# Altium schematic sheet p2_wire_compensation.SchDoc
size A2; SheetNumber: 2; SheetTotal: 2
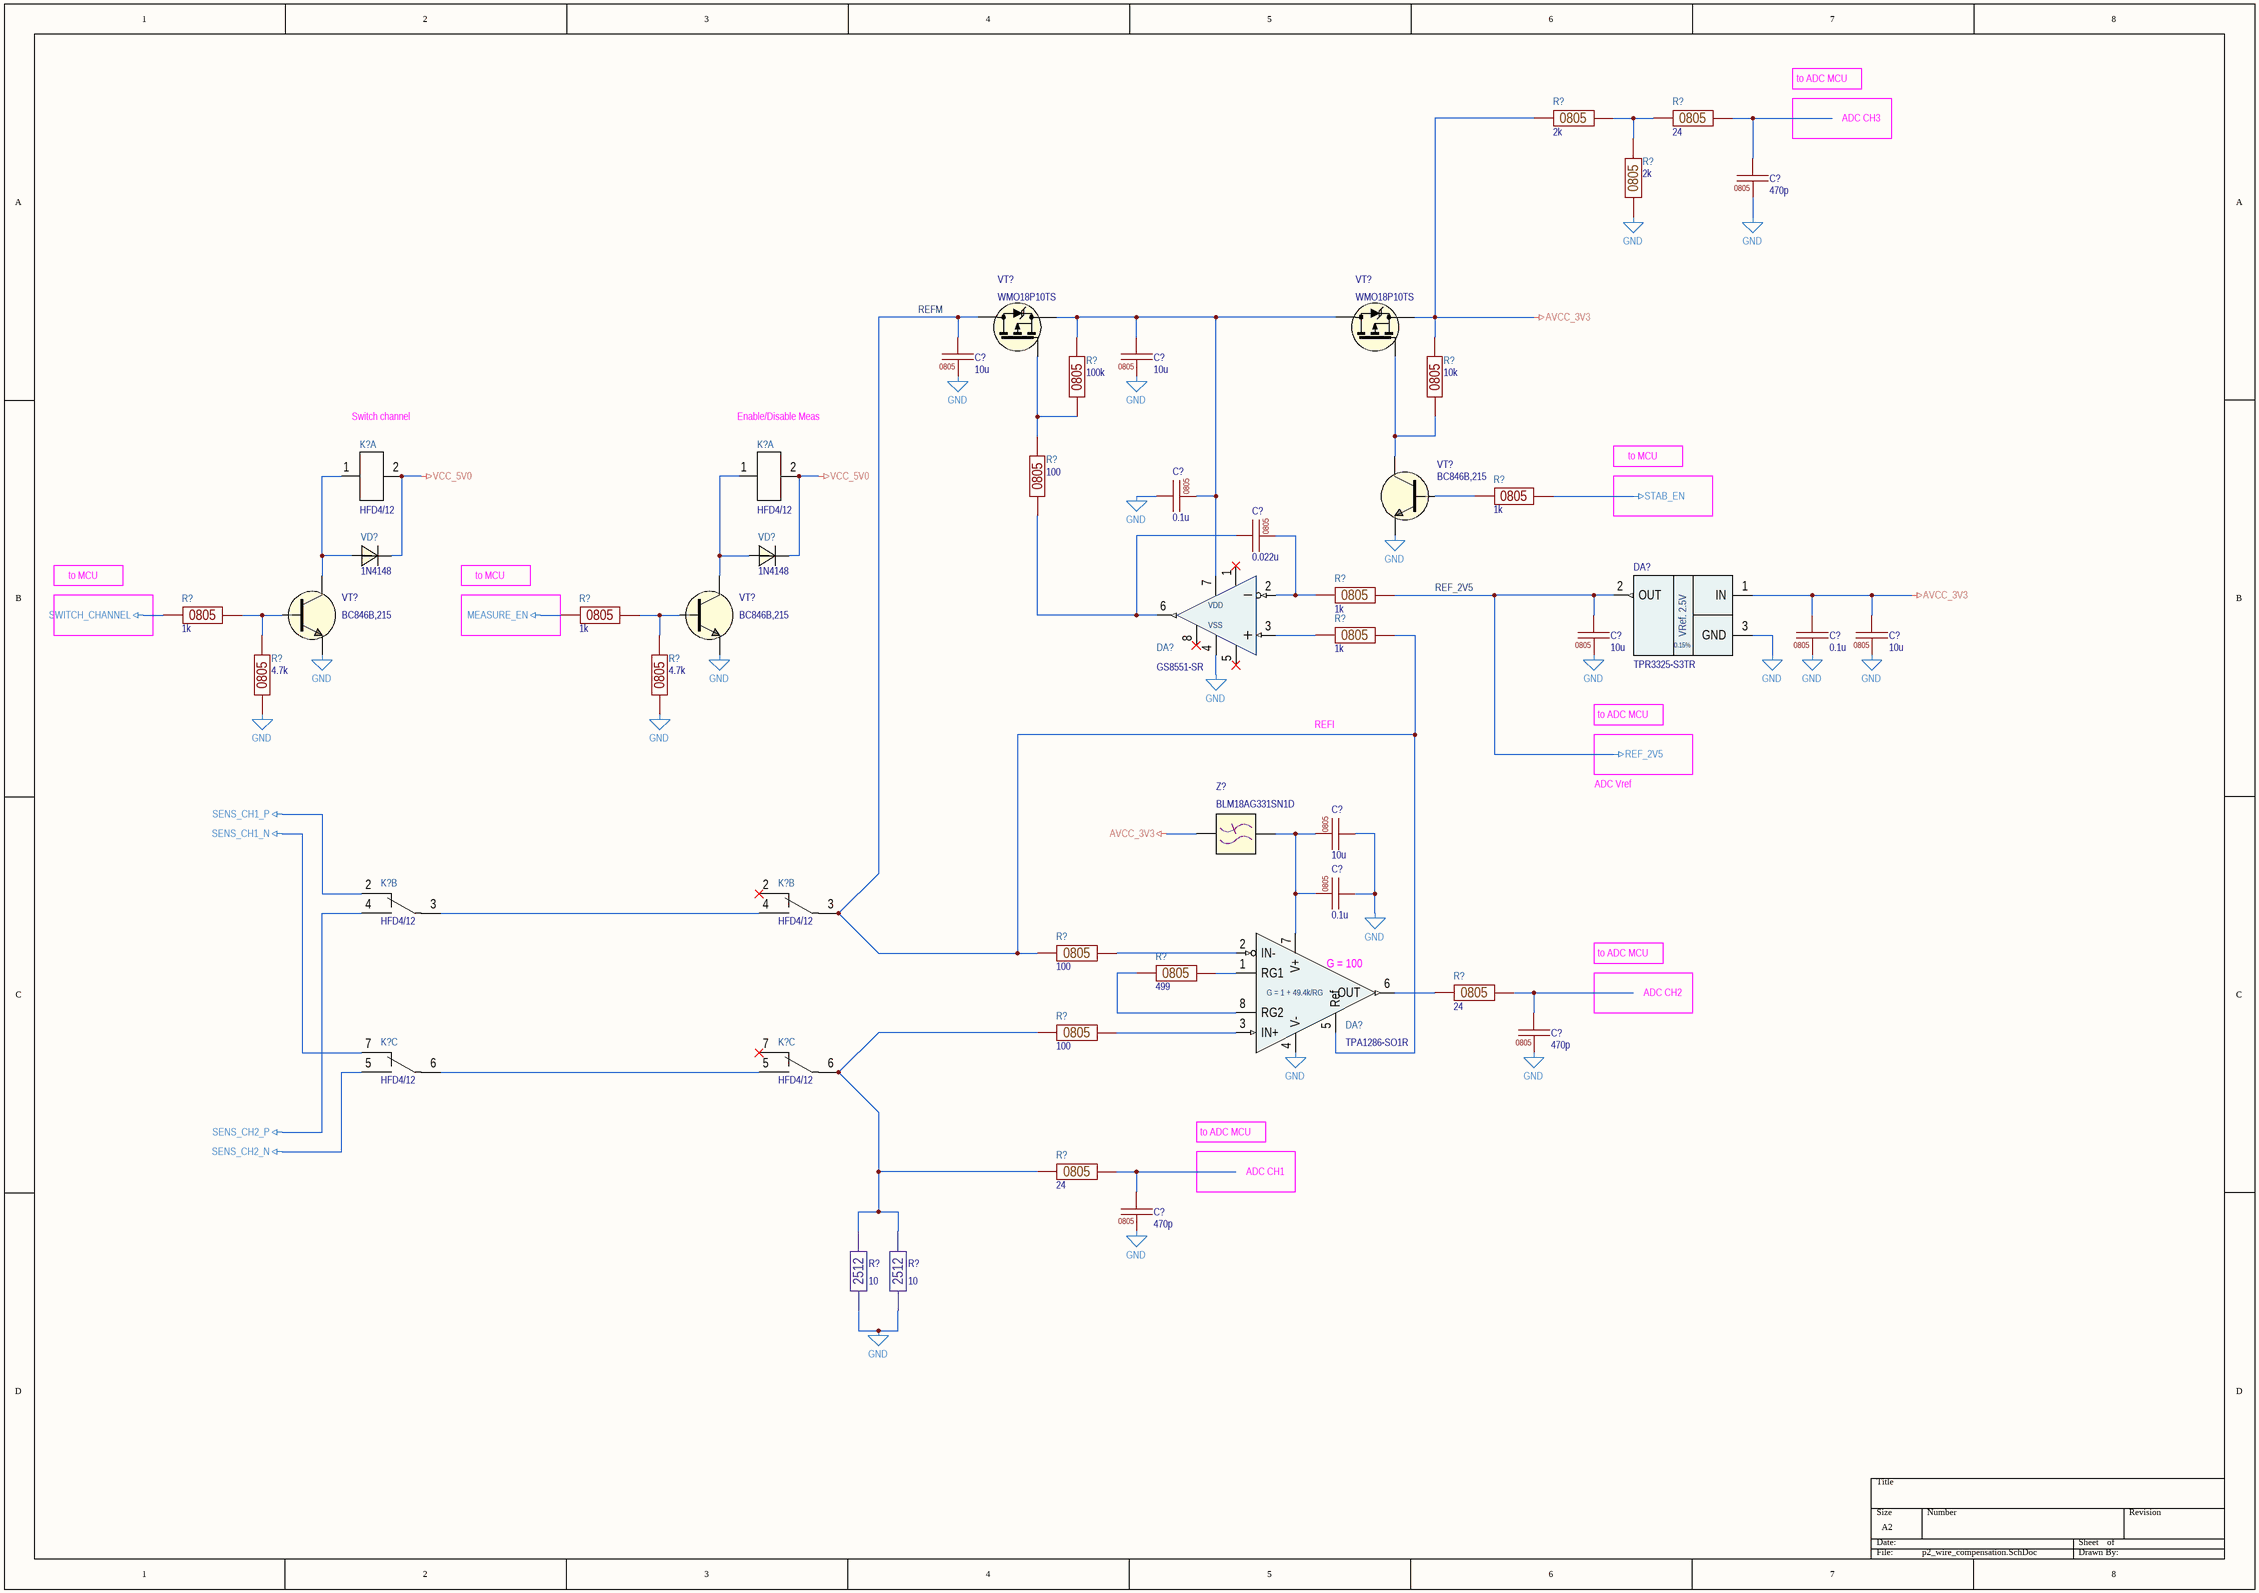
[diagram p0: p2_wire_compensation.SchDoc]

## Parts
(Parts that share a designator on the sheet are numbered #1, #2 ... from top to bottom, then left to right.)
C?#1  470p  Package: 0805  [CAP0805-0.75]
C?#2  10u  Package: 0805  [CAP0805-1.35]
C?#3  10u  Package: 0805  [CAP0805-1.35]
C?#4  0.1u  Package: 0805  [CAP0805-0.75]
C?#5  0.022u  Package: 0805  [CAP0805-0.95]
C?#6  0.1u  Package: 0805  [CAP0805-0.75]
C?#7  10u  Package: 0805  [CAP0805-1.35]
C?#8  10u  Package: 0805  [CAP0805-1.35]
C?#9  10u  Package: 0805  [CAP0805-1.35]
C?#10  0.1u  Package: 0805  [CAP0805-0.75]
C?#11  470p  Package: 0805  [CAP0805-0.75]
C?#12  470p  Package: 0805  [CAP0805-0.75]
DA?#1  GS8551-SR  [SOIC-8]
DA?#2  TPR3325-S3TR  [SOT23-3]
DA?#3  TPA1286-SO1R  [SOIC-8]
K?#1  HFD4/12  [HFD4]  (part A of 3)
K?#2  HFD4/12  [HFD4]  (part A of 3)
K?#3  HFD4/12  [HFD4]  (part B of 3)
K?#4  HFD4/12  [HFD4]  (part B of 3)
K?#5  HFD4/12  [HFD4]  (part C of 3)
K?#6  HFD4/12  [HFD4]  (part C of 3)
R?#1  2k  Package: 0805  [RES0805C]
R?#2  24  Package: 0805  [RES0805C]
R?#3  2k  Package: 0805  [RES0805C]
R?#4  100k  Package: 0805  [RES0805B]
R?#5  10k  Package: 0805  [RES0805B]
R?#6  1k  Package: 0805  [RES0805B]
R?#7  100  Package: 0805  [RES0805B]
R?#8  1k  Package: 0805  [RES0805C]
R?#9  1k  Package: 0805  [RES0805B]
R?#10  1k  Package: 0805  [RES0805B]
R?#11  1k  Package: 0805  [RES0805C]
R?#12  4.7k  Package: 0805  [RES0805B]
R?#13  4.7k  Package: 0805  [RES0805B]
R?#14  100  Package: 0805  [RES0805C]
R?#15  499  Package: 0805  [RES0805C]
R?#16  24  Package: 0805  [RES0805C]
R?#17  100  Package: 0805  [RES0805C]
R?#18  24  Package: 0805  [RES0805C]
R?#19  10  Package: 2512  [RES2512B]
R?#20  10  Package: 2512  [RES2512B]
VD?#1  1N4148  [DO-35 GLASS LIGHT RED]
VD?#2  1N4148  [DO-35 GLASS LIGHT RED]
VT?#1  WMO18P10TS  [TO-252-3]
VT?#2  WMO18P10TS  [TO-252-3]
VT?#3  BC846B,215  [SOT23-3]
VT?#4  BC846B,215  [SOT23-3]
VT?#5  BC846B,215  [SOT23-3]
Z?  BLM18AG331SN1D  [BLM0603P]

## Nets
AVCC_3V3: C?#6.1 C?#8.2 DA?#2.1(IN) R?#1.2 R?#5.2 VT?#2.3(S) Z?.1
GND: C?#1.1 C?#2.1 C?#3.1 C?#4.2 C?#6.2 C?#7.1 C?#8.1 C?#9.1 C?#10.2 C?#11.1 C?#12.1 DA?#1.4(VSS) DA?#2.3(GND) DA?#3.4(V-) R?#3.2 R?#12.1 R?#13.1 R?#19.1 R?#20.1 VT?#3.2(E) VT?#4.2(E) VT?#5.2(E)
MEASURE_EN: R?#10.1
REF_2V5: C?#7.2 DA?#2.2(OUT) R?#8.1
SENS_CH1_N: K?#5.7
SENS_CH1_P: K?#3.2
SENS_CH2_N: K?#5.5
SENS_CH2_P: K?#3.4
STAB_EN: R?#6.2
SWITCH_CHANNEL: R?#9.1
VCC_5V0: K?#1.2 K?#2.2 VD?#1.1 VD?#2.1
REFM: C?#2.2 DA?#3.5(Ref) K?#4.3 R?#11.1 R?#14.2 VT?#1.2(D)
NetC?#1_2: C?#1.2 R?#2.1
NetC?#3_2: C?#3.2 C?#4.1 DA?#1.7(VS+) R?#4.2 VT?#1.3(S) VT?#2.2(D)
NetC?#5_1: C?#5.1 DA?#1.2(IN-) R?#8.2
NetC?#5_2: C?#5.2 DA?#1.6(OUT) R?#7.1
NetC?#9_2: C?#9.2 C?#10.1 DA?#3.7(V+) Z?.2
NetC?#11_2: C?#11.2 R?#16.1
NetC?#12_2: C?#12.2 R?#18.1
NetDA?#1_3: DA?#1.3(IN+) R?#11.2
NetDA?#3_1: DA?#3.1(RG1) R?#15.1
NetDA?#3_2: DA?#3.2(IN-) R?#14.1
NetDA?#3_3: DA?#3.3(IN+) R?#17.1
NetDA?#3_6: DA?#3.6(OUT) R?#16.2
NetDA?#3_8: DA?#3.8(RG2) R?#15.2
NetK?#1_1: K?#1.1 VD?#1.2 VT?#4.3(C)
NetK?#2_1: K?#2.1 VD?#2.2 VT?#5.3(C)
NetK?#3_3: K?#3.3 K?#4.4
NetK?#5_6: K?#5.6 K?#6.5
NetK?#6_6: K?#6.6 R?#17.2 R?#18.2 R?#19.2 R?#20.2
NetR?#1_1: R?#1.1 R?#2.2 R?#3.1
NetR?#4_1: R?#4.1 R?#7.2 VT?#1.1(G)
NetR?#5_1: R?#5.1 VT?#2.1(G) VT?#3.3(C)
NetR?#6_1: R?#6.1 VT?#3.1(B)
NetR?#9_2: R?#9.2 R?#12.2 VT?#4.1(B)
NetR?#10_2: R?#10.2 R?#13.2 VT?#5.1(B)

Not connected (* = marked no-connect by the designer): DA?#1 1(NC)* 5(NC)* 8(NC)*; K?#4 2*; K?#6 7*

## Notes on the sheet
- to ADC MCU
- ADC CH3
- Switch channel
- Enable/Disable Meas
- to MCU
- REFI
- ADC Vref
- (near DA?#3) G = 100
- ADC CH2
- ADC CH1
- (in symbol GS8551-SR) VDD
- (in symbol TPA1286-SO1R) G = 1 + 49.4k/RG
- (in symbol TPR3325-S3TR) VRef. 2.5V; 0.15%

## Library data of the parts
C?#1 C?#11 C?#12 = C0805: Capacitors 0805 package case; Part Number: CL21C471JBANNNC; Manufacturer: Samsung; Tolerance: ± 5 %; Dielectric: NP0; Voltage: 50V; Value: 470p; Value on schem: 470p
C?#2 C?#3 C?#7-C?#9 = C0805: Capacitors 0805 package case; Part Number: CL21B106KAYQFNE; Manufacturer: Samsung; Tolerance: ± 10 %; Dielectric: X7R; Voltage: 25V; Value: 10u; Value on schem: 10u
C?#4 C?#6 C?#10 = C0805: Capacitors 0805 package case; Part Number: CL21B104KBCNNNC; Manufacturer: Samsung; Tolerance: ± 10 %; Dielectric: X7R; Voltage: 50V; Value: 0.1u; Value on schem: 0.1u
C?#5 = C0805: Capacitors 0805 package case; Part Number: CL21B223KBANNNC; Manufacturer: Samsung; Tolerance: ± 10 %; Dielectric: X7R; Voltage: 50V; Value: 0.022u; Value on schem: 0.022u
DA?#1 = GS8551-SR: 1.8MHZ Zero-Drift CMOS Rail-to-Rail IO Opamp with RF Filter; Manufacturer: GainSil; Package: SOIC-8; Part Number: GS8551-SR
DA?#2 = TPR3325-S3TR: 30 ppm/°C 2.5V Voltage Reference; Manufacturer: 3PEAK; Part Number: TPR3325-S3TR; Package: SOT23-3
DA?#3 = TPA1286-SO1R: High Voltage, Precision, Zero-drift, Instrumentation Amplifier; Manufacturer: 3PEAK; Part Number: TPA1286-SO1R; Package: SOIC-8
K?#1-K?#6 = HFD4/12: Subminature signal relay; Manufacturer: Hongfa; Coil Voltage: 12V; Coil Resistance: 1028 Ohm; Package: 10mm x 6.5mm; Part Number: HFD4/12
R?#1 R?#3 = R0805: Resistor 0805 package case; Part Number: ERA6AEB202V; Manufacturer: Panasonic; Tolerance: ± 0.1 %; Voltage: 100V; Temperature Coefficient: ± 25 ppm/°C; Value: 2k; Value on schem: 2k
R?#2 R?#16 R?#18 = R0805: Resistor 0805 package case; Part Number: RT0805BRD072KL; Manufacturer: Yageo; Tolerance: ± 0.1 %; Voltage: 100V; Temperature Coefficient: ± 25 ppm/°C; Value: 24; Value on schem: 24
R?#4 = R0805: Resistor 0805 package case; Part Number: RC0805FR-07100KL; Manufacturer: Yageo; Tolerance: ± 1 %; Voltage: 150V; Temperature Coefficient: ± 100ppm/°K; Value: 100k; Value on schem: 100k
R?#5 = R0805: Resistor 0805 package case; Part Number: RC0805FR-0710KL; Manufacturer: Yageo; Tolerance: ± 1 %; Voltage: 150V; Temperature Coefficient: ± 100ppm/°K; Value: 10k; Value on schem: 10k
R?#6 R?#9 R?#10 = R0805: Resistor 0805 package case; Part Number: RC0805FR-071KL; Manufacturer: Yageo; Tolerance: ± 1 %; Voltage: 150V; Temperature Coefficient: ± 100ppm/°K; Value: 1k; Value on schem: 1k
R?#7 = R0805: Resistor 0805 package case; Part Number: RC0805FR-07100RL; Manufacturer: Yageo; Tolerance: ± 1 %; Voltage: 150V; Temperature Coefficient: ± 100ppm/°K; Value: 100; Value on schem: 100
R?#8 R?#11 = R0805: Resistor 0805 package case; Part Number: ERA6AEB102V; Manufacturer: Panasonic; Tolerance: ± 0.1 %; Voltage: 100V; Temperature Coefficient: ± 25 ppm/°C; Value: 1k; Value on schem: 1k
R?#12 R?#13 = R0805: Resistor 0805 package case; Part Number: RC0805FR-074K7L; Manufacturer: Yageo; Tolerance: ± 1 %; Voltage: 150V; Temperature Coefficient: ± 100ppm/°K; Value: 4.7k; Value on schem: 4.7k
R?#14 R?#17 = R0805: Resistor 0805 package case; Part Number: ERA6AEB101V; Manufacturer: Panasonic; Tolerance: ± 0.1 %; Voltage: 100V; Temperature Coefficient: ± 25 ppm/°C; Value: 100; Value on schem: 100
R?#15 = R0805: Resistor 0805 package case; Part Number: ERA6AEB4990V; Manufacturer: Panasonic; Tolerance: ± 0.1 %; Voltage: 100V; Temperature Coefficient: ± 25 ppm/°C; Value: 499; Value on schem: 499
R?#19 R?#20 = R2512: Resistor 2512 package case; Manufacturer: Bourns; Part Number: CRM2512-FX-10R0ELF; Tolerance: ± 1 %; Voltage: 300V; Temperature Coefficient: ±100 ppm/°K; Value: 10; Value on schem: 10
VD?#1 VD?#2 = 1N4148: High-speed diode; Package: DO-35; Part Number: 1N4148
VT?#1 VT?#2 = WMO18P10TS: P-Channel MOSFET, -100V, -18A; Manufacturer: Wayon; Part Number: WMO18P10TS; Package: TO-252
VT?#3-VT?#5 = BC846B,215: General Purpose n-p-n Transistors; Manufacturer: Nexperia USA Inc.; Package: SOT23-3; Part Number: BC846B,215
Z? = BLM18AG331SN1D: Power line filter, imperdance 330 Ohm (current 05A); Part Number: BLM18AG331SN1D; Package: 0603